# EAGLE schematic USB_Dongle (EAGLE 6.5.0)
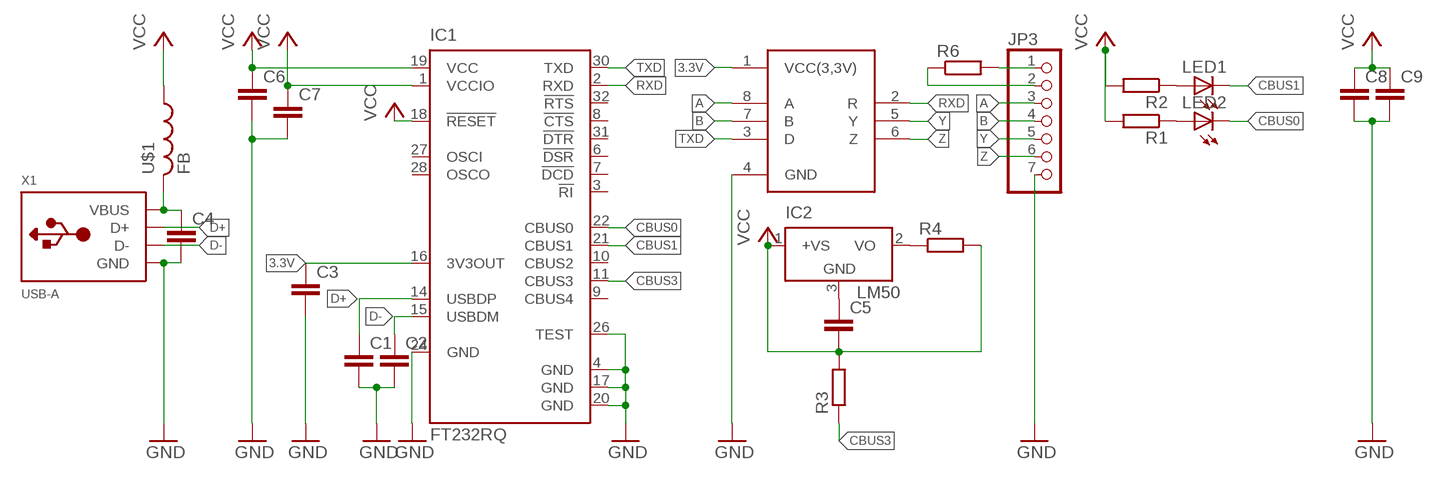
[diagram p0: schematic, sheet 1]

## Parts
C1  CC0603  [C0603]
C2  CC0603  [C0603]
C3  CC0603  [C0603]
C4  CC0603  [C0603]
C5  CC0603  [C0603]
C6  CC0603  [C0603]
C7  CC0603  [C0603]
C8  CC0603  [C0603]
C9  CC0603  [C0603]
IC1  FT232RQ  [QFN32]
IC2  LM50  [SOT23]
JP3  PINHD-1X7  [1X07]
LED1  LED_ESML0603  [LED_SML0603]
LED2  LED_ESML0603  [LED_SML0603]
R1  R-EU_R0603  [R0603]
R2  R-EU_R0603  [R0603]
R3  R-EU_R0603  [R0603]
R4  R-EU_R0603  [R0603]
R6  R-EU_R0603  [R0603]
U$1  FB  [FB]
U$2  SN65HVD77D  [SOIC-8]
X1  USB-A  [MOLEX_480371000]

## Nets
3.3V: C3.1 IC1.16(3V3OUT) U$2.1(VCC(3,3V))
A: JP3.3 U$2.8(A)
B: JP3.4 U$2.7(B)
CBUS0: IC1.22(CBUS0) LED2.C
CBUS1: IC1.21(CBUS1) LED1.C
CBUS3: IC1.11(CBUS3) R3.1
D+: C1.1 IC1.14(USBDP) X1.3(D+)
D-: C2.1 IC1.15(USBDM) X1.2(D-)
GND: C1.2 C2.2 C3.2 C4.2 C6.2 C7.2 C8.2 C9.2 IC1.4(GND) IC1.17(GND) IC1.20(GND) IC1.24(GND) IC1.26(TEST) JP3.7 U$2.4(GND) X1.4(GND)
N$1: C4.1 U$1.P$2 X1.1(VBUS)
N$2: JP3.2 R6.1
N$3: IC1.18(!RESET) ; supply symbol labelled VCC
N$7: LED2.A R1.1
N$8: LED1.A R2.1
N$9: JP3.1 R6.2
N$11: C5.1 IC2.3(GND)
N$12: IC2.2(VO) R4.1
RXD: IC1.2(RXD) U$2.2(R)
TXD: IC1.30(TXD) U$2.3(D)
VCC: C5.2 C6.1 C7.1 C8.1 C9.1 IC1.1(VCCIO) IC1.19(VCC) IC2.1(+VS) R1.2 R2.2 R3.2 R4.2 U$1.P$1
Y: JP3.5 U$2.5(Y)
Z: JP3.6 U$2.6(Z)
Unconnected: IC1.3(!RI) IC1.6(!DSR) IC1.7(!DCD) IC1.8(!CTS) IC1.9(CBUS4) IC1.10(CBUS2) IC1.27(OSCI) IC1.28(OSCO) IC1.31(!DTR) IC1.32(!RTS)

## Library data of the parts
C1-C9 = eagle-ltspice:C: CAPACITOR, European symbol; SPICEMODEL: NONE; SPICEPREFIX: C
IC1 = ftdichip:FT232R: Source: http://www.ftdichip.com/Documents/DataSheets/DS_FT232R_v104.pdf; MPN: FT232RQ; OC_FARNELL: 1146033; OC_NEWARK: 91K9919
IC2 = linear:LM50: SOT-23 Single-Supply Centigrade Temperature Sensor Vout = (10mV/°C x Temp °C) +5mmmV Source: http://cache.national.com/ds/LM/LM50.pdf
JP3 = pinhead:PINHD-1X7: PIN HEADER
LED1 LED2 = eagle-ltspice:LED_E: LED Source: http://www.osram.convergy.de Source: www.luxeon.com Source: www.kingbright.com; SPICEMODEL: NONE; SPICEPREFIX: D; SPICETYPE: diode
R1-R4 R6 = resistor:R-EU_: RESISTOR, European symbol
U$1 = adafruit:FB: Ferrite bead Digikey #P9821BK-ND
U$2 = Kommunikatsioon:SN65HVD77D
X1 = adafruit:USB-A: USB type A 'plug' Used for things that can directly connect to a USB port, say USB key